# EAGLE schematic lada_dash_v2 (EAGLE 7.2.0)
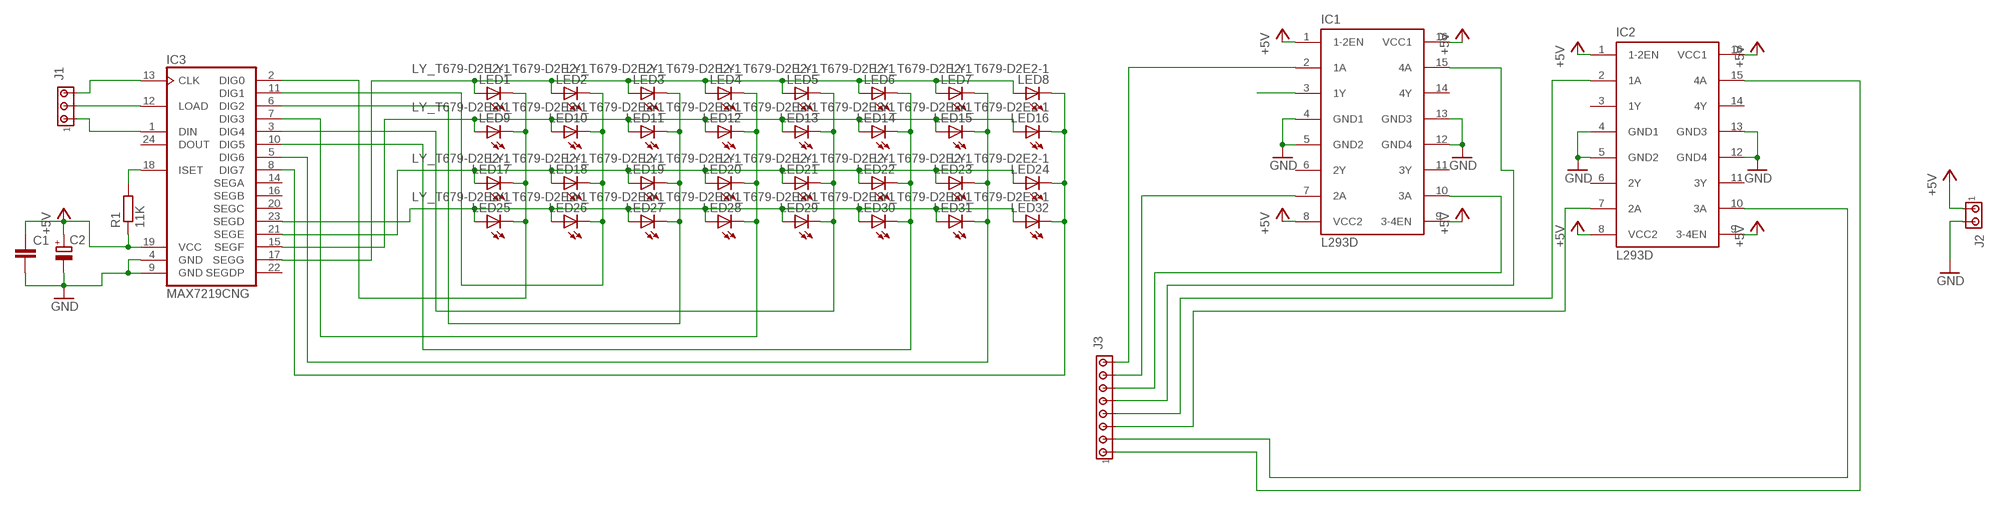
[diagram p0: schematic, sheet 1]

## Parts
C1  C-EU025-025X050  [C025-025X050]
C2  CPOL-EUE2.5-5  [E2,5-5]
IC1  L293D  [DIL16]
IC2  L293D  [DIL16]
IC3  MAX7219CNG  [DIL24-3]
J1  MTA03-100  [10X03MTA]
J2  MTA02-100  [10X02MTA]
J3  MTA08-100  [10X08MTA]
LED1  LY_T679-D2E2-1  [PLCC2]
LED2  LY_T679-D2E2-1  [PLCC2]
LED3  LY_T679-D2E2-1  [PLCC2]
LED4  LY_T679-D2E2-1  [PLCC2]
LED5  LY_T679-D2E2-1  [PLCC2]
LED6  LY_T679-D2E2-1  [PLCC2]
LED7  LY_T679-D2E2-1  [PLCC2]
LED8  LY_T679-D2E2-1  [PLCC2]
LED9  LY_T679-D2E2-1  [PLCC2]
LED10  LY_T679-D2E2-1  [PLCC2]
LED11  LY_T679-D2E2-1  [PLCC2]
LED12  LY_T679-D2E2-1  [PLCC2]
LED13  LY_T679-D2E2-1  [PLCC2]
LED14  LY_T679-D2E2-1  [PLCC2]
LED15  LY_T679-D2E2-1  [PLCC2]
LED16  LY_T679-D2E2-1  [PLCC2]
LED17  LY_T679-D2E2-1  [PLCC2]
LED18  LY_T679-D2E2-1  [PLCC2]
LED19  LY_T679-D2E2-1  [PLCC2]
LED20  LY_T679-D2E2-1  [PLCC2]
LED21  LY_T679-D2E2-1  [PLCC2]
LED22  LY_T679-D2E2-1  [PLCC2]
LED23  LY_T679-D2E2-1  [PLCC2]
LED24  LY_T679-D2E2-1  [PLCC2]
LED25  LY_T679-D2E2-1  [PLCC2]
LED26  LY_T679-D2E2-1  [PLCC2]
LED27  LY_T679-D2E2-1  [PLCC2]
LED28  LY_T679-D2E2-1  [PLCC2]
LED29  LY_T679-D2E2-1  [PLCC2]
LED30  LY_T679-D2E2-1  [PLCC2]
LED31  LY_T679-D2E2-1  [PLCC2]
LED32  LY_T679-D2E2-1  [PLCC2]
R1  11K  R-EU_0207/10  [0207/10]

## Nets
+5V: C1.1 C2.+ IC1.1(1-2EN) IC1.8(VCC2) IC1.9(3-4EN) IC1.16(VCC1) IC2.1(1-2EN) IC2.8(VCC2) IC2.9(3-4EN) IC2.16(VCC1) IC3.19(VCC) J2.1 R1.1
GND: C1.2 C2.- IC1.4(GND1) IC1.5(GND2) IC1.12(GND4) IC1.13(GND3) IC2.4(GND1) IC2.5(GND2) IC2.12(GND4) IC2.13(GND3) IC3.4(GND) IC3.9(GND) J2.2
N$1: IC3.17(SEGG) LED1.A LED2.A LED3.A LED4.A LED5.A LED6.A LED7.A LED8.A
N$2: IC3.15(SEGF) LED9.A LED10.A LED11.A LED12.A LED13.A LED14.A LED15.A LED16.A
N$3: IC3.21(SEGE) LED17.A LED18.A LED19.A LED20.A LED21.A LED22.A LED23.A LED24.A
N$4: IC3.23(SEGD) LED25.A LED26.A LED27.A LED28.A LED29.A LED30.A LED31.A LED32.A
N$5: IC3.2(DIG0) LED1.C LED9.C LED17.C LED25.C
N$6: IC3.11(DIG1) LED2.C LED10.C LED18.C LED26.C
N$7: IC3.6(DIG2) LED3.C LED11.C LED19.C LED27.C
N$8: IC3.7(DIG3) LED4.C LED12.C LED20.C LED28.C
N$9: IC3.3(DIG4) LED5.C LED13.C LED21.C LED29.C
N$10: IC3.10(DIG5) LED6.C LED14.C LED22.C LED30.C
N$11: IC3.5(DIG6) LED7.C LED15.C LED23.C LED31.C
N$12: IC3.8(DIG7) LED8.C LED16.C LED24.C LED32.C
N$13: IC3.13(CLK) J1.3
N$14: IC3.12(LOAD) J1.2
N$17: IC3.1(DIN) J1.1
N$24: IC1.2(1A) J3.8
N$25: IC1.7(2A) J3.7
N$26: IC1.10(3A) J3.6
N$27: IC1.15(4A) J3.5
N$28: IC2.2(1A) J3.4
N$29: IC2.7(2A) J3.3
N$30: IC2.10(3A) J3.2
N$31: IC2.15(4A) J3.1
N$35: IC3.18(ISET) R1.2
STEP1A: IC1.3(1Y)
Unconnected: IC1.6(2Y) IC1.11(3Y) IC1.14(4Y) IC2.3(1Y) IC2.6(2Y) IC2.11(3Y) IC2.14(4Y) IC3.14(SEGA) IC3.16(SEGB) IC3.20(SEGC) IC3.22(SEGDP) IC3.24(DOUT)

## Library data of the parts
C1 = resistor:C-EU: CAPACITOR, European symbol
C2 = rcl:CPOL-EU: POLARIZED CAPACITOR, European symbol
IC1 IC2 = st-microelectronics:L293D: PUSH-PULL 4 CHANNEL DRIVER; MPN: L293D; OC_FARNELL: 9589619; OC_NEWARK: 56P8249
IC3 = maxim:MAX7219CNG: LED DISPLAY DRIVER; MF: MAXIM; MPN: MAX7219CNG; OC_FARNELL: 1523914; OC_NEWARK: 34C4018
J1 = con-amp:MTA03-100: AMP connector
J2 = con-amp:MTA02-100: AMP connector
J3 = con-amp:MTA08-100: AMP connector
LED1-LED32 = led:*_T679-?-1: LC TOPLED® Low Current LED Source: http://catalog.osram-os.com .. LG_LS_LY_T679_OBS.pdf; COLOR: yellow
R1 = resistor:R-EU_: RESISTOR, European symbol